# Altium schematic sheet Pulsadores.SchDoc
size A4
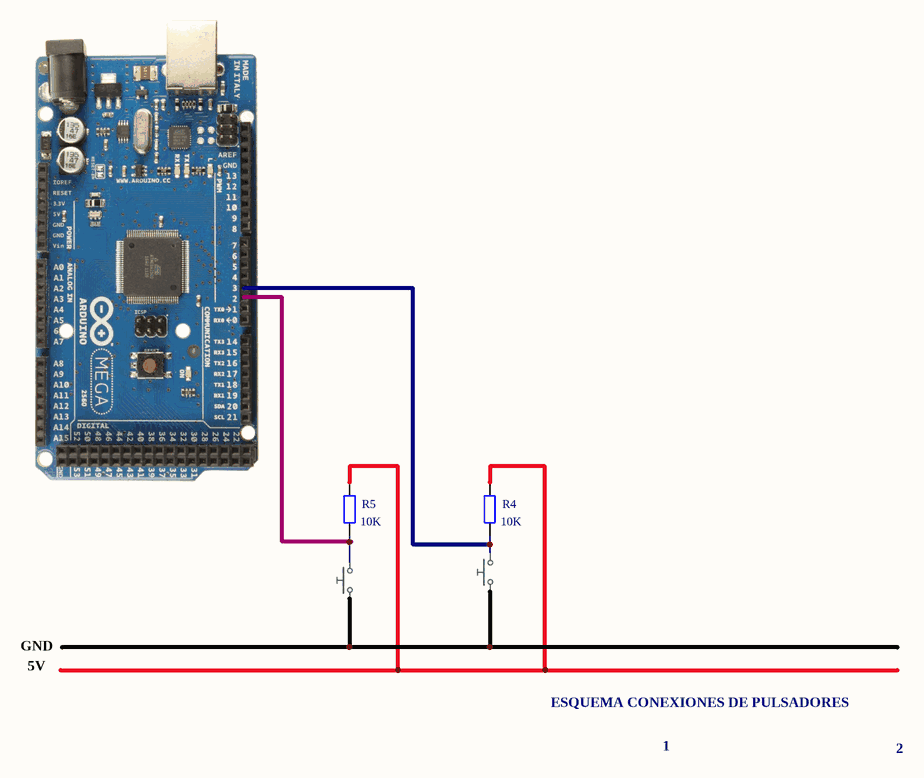
[diagram p0: Pulsadores.SchDoc]

## Parts
R4  value 10K  [AXIAL-0.4]  (hidden comment: Res2)
R5  value 10K  [AXIAL-0.4]  (hidden comment: Res2)

## Nets
NetR4_2: R4.2 R5.2

Not connected (* = marked no-connect by the designer): R4 1; R5 1

## Notes on the sheet
- GND
- 5V
- ESQUEMA CONEXIONES DE PULSADORES
- 1
- 2

## Library data of the parts
R4 R5 = Res2: Resistor; Published: 8-Jun-2000; LatestRevisionDate: 17-Jul-2002; LatestRevisionNote: Re-released for DXP Platform.; PackageReference: AXIAL-0.4; Publisher: Altium Limited; PackageDescription: Axial Device, Thru-Hole; 2 Leads; 0.4 in Pin Spacing